# Altium schematic sheet Realtime.SchDoc
size A; SheetNumber: 6; SheetTotal: 11
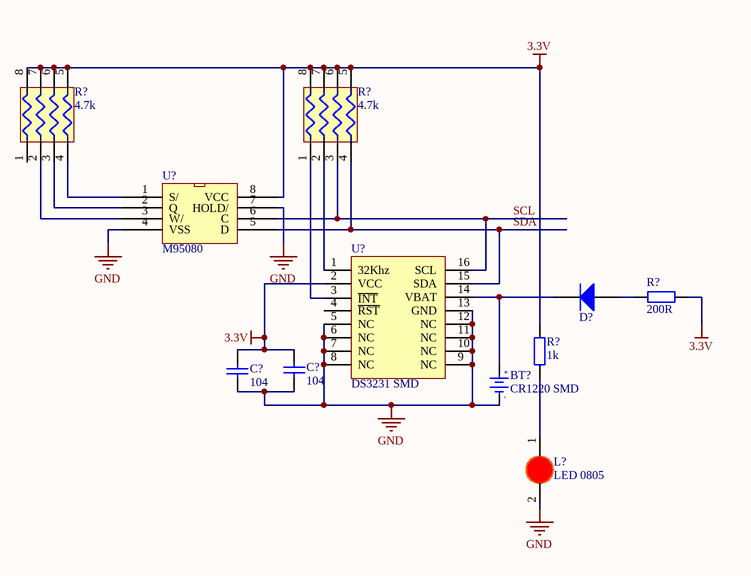
[diagram p0: Realtime.SchDoc]

## Parts
(Parts that share a designator on the sheet are numbered #1, #2 ... from top to bottom, then left to right.)
BT?  CR1220 SMD  [DE PIN CR1220]
C?#1  104  [tu 0805]
C?#2  104  [tu 0805]
D?  Diode  [SOD80]  (value not drawn)
L?  LED 0805  [LED-0805-Red]
R?#1  4.7k  [tro bang 0603 4]
R?#2  4.7k  [tro bang 0603 4]
R?#3  200R  [tro smd 0805]
R?#4  1k  [tro smd 0805]
U?#1  M95080  [SOP8_L]
U?#2  DS3231 SMD  [SOIC 16]

## Nets
3.3V: C?#1.1 C?#2.1 R?#1.5 R?#1.6 R?#1.7 R?#1.8 R?#2.5 R?#2.6 R?#2.7 R?#2.8 R?#3.2 R?#4.2 U?#1.8(VCC) U?#2.2(VCC)
GND: BT?.2(GND) C?#1.2 C?#2.2 L?.2(K) U?#1.4(VSS) U?#1.7(HOLD/) U?#2.5(NC) U?#2.6(NC) U?#2.7(NC) U?#2.8(NC) U?#2.9(NC) U?#2.10(NC) U?#2.11(NC) U?#2.12(NC) U?#2.13(GND)
SCL: R?#2.3 U?#1.6(C) U?#2.16(SCL)
SDA: R?#2.4 U?#1.5(D) U?#2.15(SDA)
NetBT?_1: BT?.1(+3V) D?.2(K) U?#2.14(VBAT)
NetD?_1: D?.1(A) R?#3.1
NetL?_1: L?.1(A) R?#4.1
NetR?#1_2: R?#1.2 U?#1.3(W/)
NetR?#1_3: R?#1.3 U?#1.2(Q)
NetR?#1_4: R?#1.4 U?#1.1(S/)
NetR?#2_1: R?#2.1 U?#2.3(~{INT})
NetR?#2_2: R?#2.2 U?#2.1(32Khz)

Not connected (* = marked no-connect by the designer): R?#1 1; U?#2 4(~{RST})

## Notes on the sheet
- (in symbol De pin CR1220 SMD) +; -

## Library data of the parts
BT? = De pin CR1220 SMD: Ten: Đế PIN CR1220 SMD; Ma_Hang: MH000833
C?#1 C?#2 = Tu 0805 104 50V 10%: Dán; Don_Vi: Con; So_Chan: 2; Ten_Linh_Kien: Tụ 0805 104-100nF 10% 50V; Ma_Hang: MH004551; Chung_Loai: Dán; Kieu_Chan: *
D? = Diode: Default Diode; Published: 8-Jun-2000; LatestRevisionDate: 17-Jul-2002; LatestRevisionNote: Re-released for DXP Platform.; PackageVersion: Sep-1996; PackageReference: SMC; Publisher: Altium Limited; Code_JEDEC: DO-214-AB
L? = LED 0805 Do: Dán; Don_Vi: Con; Ma_Hang: MH000897; Ten_Linh_Kien: LED 0805 Màu Đỏ (Red); Ghi_Chu: *; Kieu_Chan: *; Chung_Loai: Dán
R?#1 R?#2 = Tro bang 0603 4.7k: Dán; Don_Vi: Con; So_Chan: 8; Ten_Linh_Kien: Trở băng 0603x4 4.7k; Ma_Hang: MH001448; Chung_Loai: Dán; Kieu_Chan: *
R?#3 = Tro 0805 5% 220R: Dán; Don_Vi: Con; So_Chan: 2; Ten_Linh_Kien: Trở 0805 5% 220R; Ma_Hang: MH005259; Chung_Loai: Dán; Kieu_Chan: *
R?#4 = Tro 0805 1% 1k: Dán; Don_Vi: Con; So_Chan: 2; Ten_Linh_Kien: Trở 0805 1% 1k; Ma_Hang: MH005468; Chung_Loai: Dán; Kieu_Chan: *
U?#1 = EEPROM_M95080
U?#2 = DS3231 SMD: SOIC